# EAGLE board SparkFun_USDA_Watershed_Monitor (EAGLE 9.6.2)
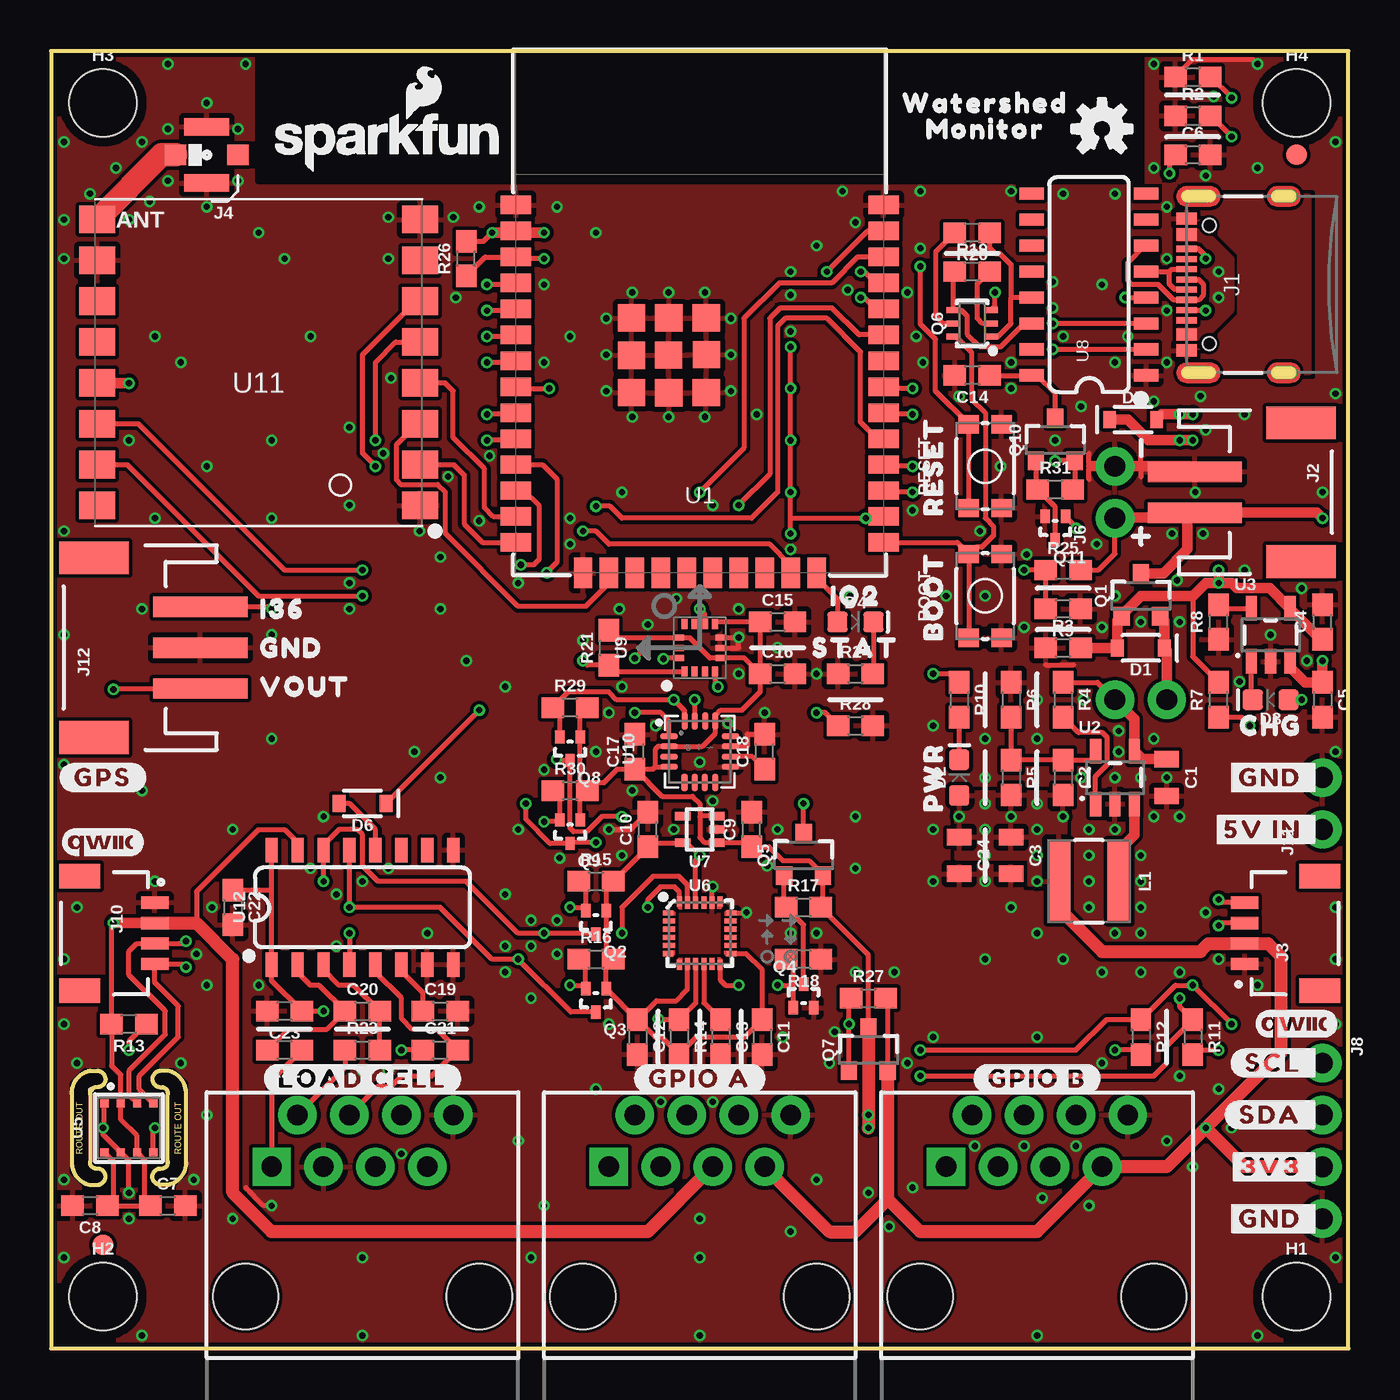
[diagram p1: board, top side]
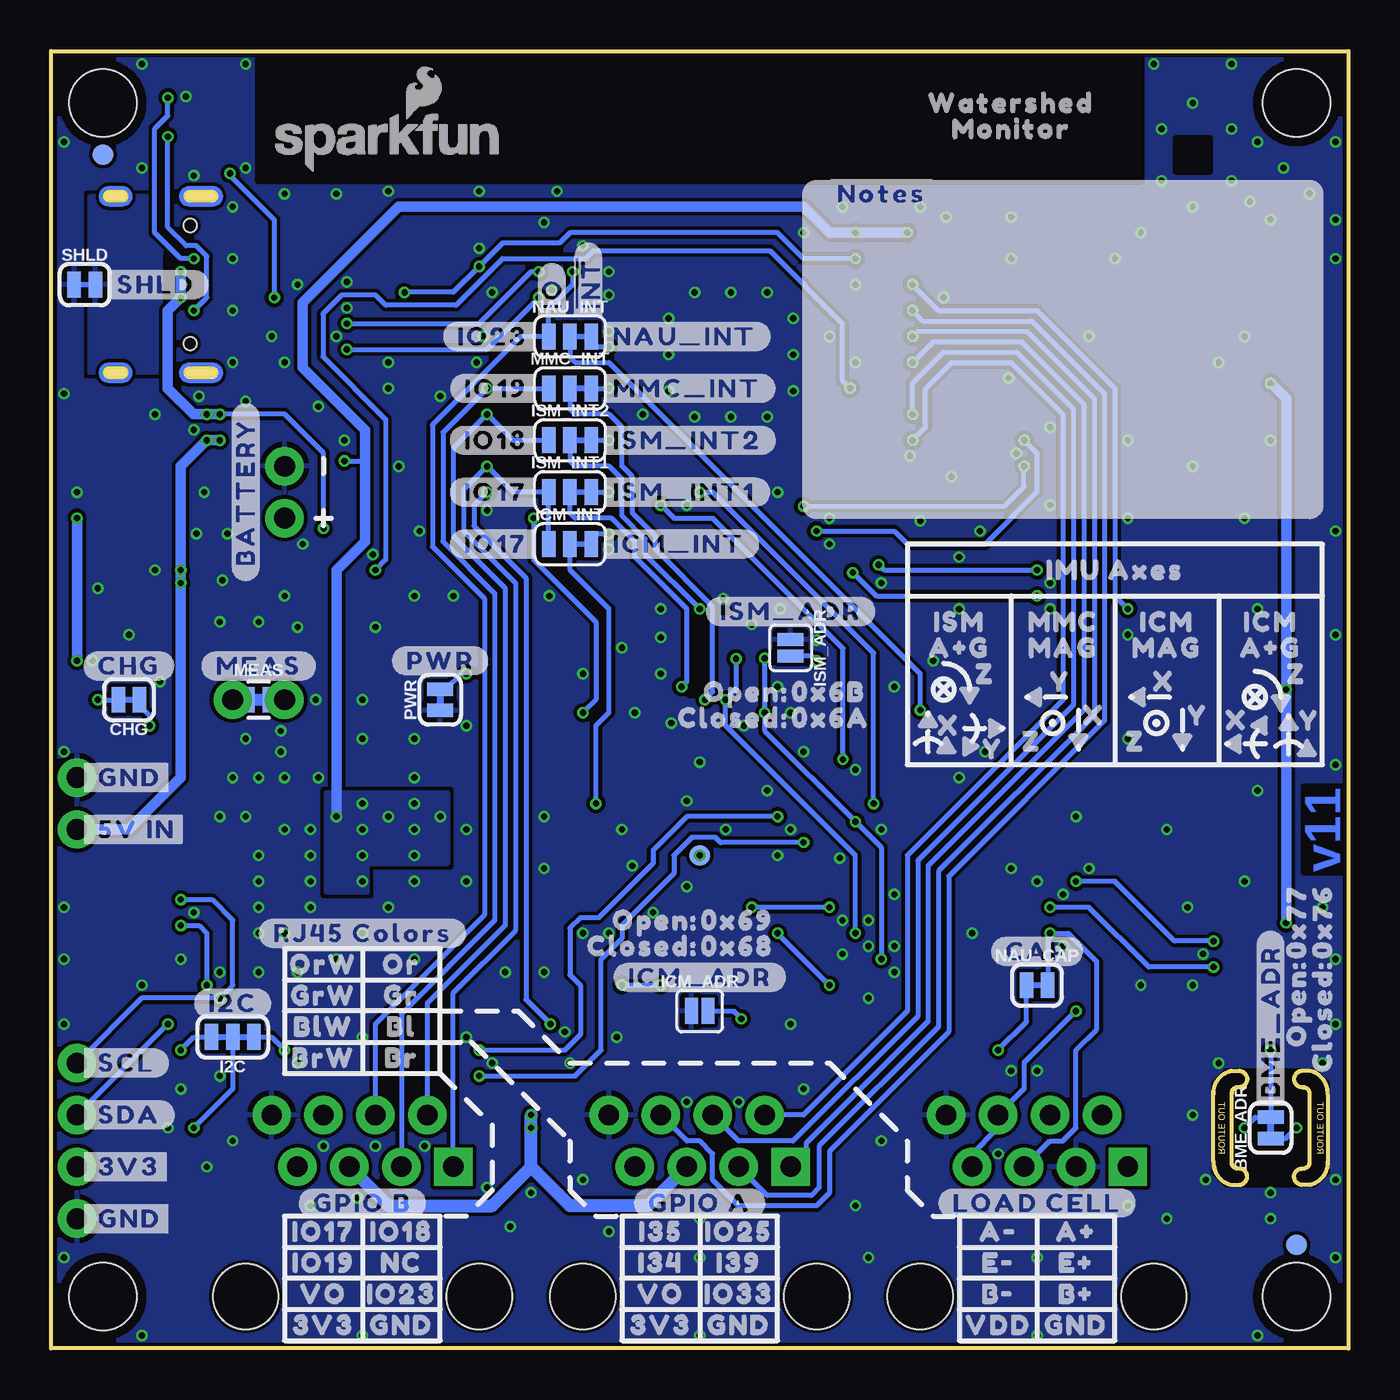
[diagram p2: board, bottom side, seen from below]

Size 63.5 x 63.5 mm. Coordinates in mm from the lower left corner, seen from the top.
Outline: 0,0 63.5,0 63.5,63.5 0,63.5 0,0
Copper layers (1*16): Top 0.035mm / dielectric 1.5mm / Bottom 0.035mm
Design rules "SparkFun-2-Layer-Minimum-JLCPCB": minimum track width 5mil, minimum drill 0.3mm, track to track 5mil, track to pad 5mil, pad to pad 5mil, via to via 5mil, smd to smd 5mil, copper to edge 7mil, drill to drill 7mil, minimum pad ring 5mil, minimum via ring 5mil, stop-mask expansion 2.5mil, vias tented up to drill 25mil, thermal gap 10mil
tRestrict: area 10.2,57.2 to 53.3,63.5; area 11.3,19.2 to 11.6,19.3; area 12.6,19.2 to 12.8,19.3; area 13.8,19.1 to 14.1,19.2; area 15.1,19.2 to 15.4,19.3; area 16.4,19.2 to 16.6,19.3; area 48,51.9 to 48.5,52.2; area 48,50.7 to 48.5,50.9; area 48,49.4 to 48.5,49.7; area 53.6,53.2 to 54.1,53.5
bRestrict: area 10.2,57.2 to 53.3,63.5; area 31.9,32 to 32.3,32.1; area 30.4,36.1 to 30.7,36.2
Milling: 44 lines

## Footprints (pad centres in the part's own frame; a part is rotated, then mirrored left to right if it is on the bottom)
SMT-JUMPER_2_NC_TRACE_SILK = smd 0.66 x 1.27: 1 -0.521,0; 2 0.521,0
TACTILE_SWITCH_SMD_4.6X2.8MM = smd 0.9 x 1: 1 -2.05,-0.8; 2 2.05,-0.8; 3 2.05,0.8; 4 -2.05,0.8
0805 = smd 0.8 x 1.2: 1 -0.9,0; 2 0.9,0
0603 = smd 1.1 x 1: 1 -0.85,0; 2 0.85,0
SOD-323 = smd 0.63 x 0.83: A 1.15,0; C -1.15,0
LED-0603 = smd 1 x 1: A -0.877,0; C 0.877,0
FIDUCIAL-1X2 = smd 1 x 1: 1 0,0
STAND-OFF = hole 3.302: 0,0
SMT-JUMPER_3_2-NC_TRACE_SILK = smd 0.66 x 1.27: 1 -1.041,0; 2 0,0; 3 1.041,0
SMT-JUMPER_2_NO_SILK = smd 0.635 x 1.27: 1 -0.406,0; 2 0.406,0
SMT-JUMPER_3_1-NC_TRACE_SILK = smd 0.66 x 1.27: 1 -1.041,0; 2 0,0; 3 1.041,0
USB-C-16P-2LAYER-PADS = smd 0.3 x 1: A5 -1.25,-0.34; A6 -0.25,-0.34; A7 0.25,-0.34; A8 1.25,-0.34; B5 1.75,-0.34; B6 0.75,-0.34; B7 -0.75,-0.34; B8 -1.75,-0.34 | smd 0.6 x 1: GND -3.225,-0.34; GND2 3.225,-0.34; VBUS1 -2.45,-0.34; VBUS2 2.45,-0.34 | drill 0.4 pad 0.6 long: SHLD1 -4.318,-0.915; SHLD2 4.318,-0.915; SHLD3 -4.318,-5.095; SHLD4 4.318,-5.095 | hole 0.65: -2.89,-1.445; 2.89,-1.445
JST-2-SMD = smd 1 x 4.6: 1 -1,-3.7; 2 1,-3.7 | smd 1.6 x 3.4: NC1 -3.4,1.5; NC2 3.4,1.5
JST04_1MM_RA = smd 0.6 x 1.35: 1 -1.5,0; 2 -0.5,0; 3 0.5,0; 4 1.5,0 | smd 1.2 x 2: NC1 2.8,-3.675; NC2 -2.8,-3.675
U.FL = smd 2.2 x 0.85: 1 0,1.375; 2 0,-1.375 | smd 1.05 x 1: FEED 1.525,0; NC -1.525,0
RJ45-8 = drill 1 pad 1.88 square: 1 -4.445,6.35 | drill 1 pad 1.88: 2 -3.175,8.89; 3 -1.905,6.35; 4 -0.635,8.89; 5 0.635,6.35; 6 1.905,8.89; 7 3.175,6.35; 8 4.445,8.89 | hole 3.2: -5.715,0; 5.715,0
1X02_NO_SILK = drill 1.016 pad 1.88: 1 0,0; 2 2.54,0
1X04_NO_SILK = drill 1.016 pad 1.88: 1 0,0; 2 2.54,0; 3 5.08,0; 4 7.62,0
JST-3-SMD = smd 1 x 4.6: 1 2.01,-4.77; 2 0.01,-4.77; 3 -1.99,-4.77 | smd 1.6 x 3.4: NC1 -4.39,0.43; NC2 4.41,0.43
INDUCTOR_4X4MM = smd 4.089 x 1.143: P$1 0,1.473; P$2 0,-1.473
COMBO-JUMPER_2_NC_TRACE = smd 0.635 x 1.27: 1 -0.508,0; 2 0.508,0 | drill 1.016 pad 1.88: 3 -1.27,0; 4 1.27,0
SOT23-3 = smd 0.8 x 0.9: 1 -0.95,-1; 2 0.95,-1; 3 0,1.1
SOT-416FL = smd 0.46 x 0.65: 1 -0.5,-1.1; 2 0.5,-1.1; 3 0,0.05
SC70-6 = smd 0.3 x 0.66: 1 -0.65,-0.92; 2 0,-0.92; 3 0.65,-0.92; 4 0.65,0.92; 5 0,0.92; 6 -0.65,0.92
PAD.03X.04 = smd 1.016 x 1.016: 1 0,0
ESP-WROOM-32D = smd 0.9 x 1.5: 1 6.43,9; 2 5.16,9; 3 3.89,9; 4 2.62,9; 5 1.35,9; 6 0.08,9; 7 -1.19,9; 8 -2.46,9; 9 -3.73,9; 10 -5,9; 11 -6.27,9; 12 -7.54,9; 13 -8.81,9; 14 -10.08,9; 25 -10.08,-9; 26 -8.81,-9; 27 -7.54,-9; 28 -6.27,-9; 29 -5,-9; 30 -3.73,-9; 31 -2.46,-9; 32 -1.19,-9; 33 0.08,-9; 34 1.35,-9; 35 2.62,-9; 36 3.89,-9; 37 5.16,-9; 38 6.43,-9 | smd 1.5 x 0.9: 15 -11.57,5.715; 16 -11.57,4.445; 17 -11.57,3.175; 18 -11.57,1.905; 19 -11.57,0.635; 20 -11.57,-0.635; 21 -11.57,-1.905; 22 -11.57,-3.175; 23 -11.57,-4.445; 24 -11.57,-5.715 | smd 1.33 x 1.33: GND -0.912,1.531; GNDT1 -2.751,3.346; GNDT2 -2.761,1.516; GNDT3 -2.751,-0.314; GNDT4 -0.891,-0.324; GNDT5 0.909,-0.314; GNDT6 0.909,1.516; GNDT7 0.909,3.346; GNDT8 -0.921,3.346
SOT23-5 = smd 0.55 x 1.2: 1 -0.95,-1.3; 2 0,-1.3; 3 0.95,-1.3; 4 0.95,1.3; 5 -0.95,1.3
LGA3.0X3.0 = smd 0.4 x 0.4: 1 1.2,1.2; 2 1.2,0.4; 3 1.2,-0.4; 4 1.2,-1.2; 5 -1.2,-1.2; 6 -1.2,-0.4; 7 -1.2,0.4; 8 -1.2,1.2
QFN24-3X3-ICM-20948 = smd 0.495 x 0.25: 1 -1.552,1; 6 -1.552,-1; 13 1.552,-1; 18 1.552,1 | smd 0.6 x 0.25: 2 -1.5,0.6; 3 -1.5,0.2; 4 -1.5,-0.2; 5 -1.5,-0.6; 14 1.5,-0.6; 15 1.5,-0.2; 16 1.5,0.2; 17 1.5,0.6 | smd 0.25 x 0.495: 7 -1,-1.552; 12 1,-1.552; 19 1,1.552; 24 -1,1.552 | smd 0.25 x 0.6: 8 -0.6,-1.5; 9 -0.2,-1.5; 10 0.2,-1.5; 11 0.6,-1.5; 20 0.6,1.5; 21 0.2,1.5; 22 -0.2,1.5; 23 -0.6,1.5
SC70 = smd 0.4 x 0.75: 1 -0.65,-0.825; 2 0,-0.825; 3 0.65,-0.825; 4 0.65,0.825; 5 -0.65,0.825
SO016 = smd 0.6 x 1.2: 1 -4.445,-2.8; 2 -3.175,-2.8; 3 -1.905,-2.8; 4 -0.635,-2.8; 5 0.635,-2.8; 6 1.905,-2.8; 7 3.175,-2.8; 8 4.445,-2.8; 9 4.445,2.8; 10 3.175,2.8; 11 1.905,2.8; 12 0.635,2.8; 13 -0.635,2.8; 14 -1.905,2.8; 15 -3.175,2.8; 16 -4.445,2.8
LGA-14L = smd 0.48 x 0.3: P1 -1.163,0.75; P2 -1.163,0.25; P3 -1.163,-0.25; P4 -1.163,-0.75; P8 1.163,-0.75; P9 1.163,-0.25; P10 1.163,0.25; P11 1.163,0.75 | smd 0.3 x 0.48: P5 -0.5,-1; P6 0,-1; P7 0.5,-1; P12 0.5,1; P13 0,1; P14 -0.5,1
LGA-16-3X3MM-4X4PINS = smd 0.3 x 0.85: 1 0.754,1.498; 2 0.254,1.498; 3 -0.246,1.498; 4 -0.746,1.498; 9 -0.746,-1.506; 10 -0.246,-1.506; 11 0.254,-1.506; 12 0.754,-1.506 | smd 0.85 x 0.3: 5 -1.508,0.746; 6 -1.508,0.246; 7 -1.508,-0.254; 8 -1.508,-0.754; 13 1.496,-0.764; 14 1.496,-0.264; 15 1.496,0.236; 16 1.496,0.736
RFM95 = smd 1.75 x 1.35: 3.3V 7.9,1; !RESET -7.9,-3; ANT 7.9,-7; DIO0 7.9,3; DIO1 7.9,5; DIO2 7.9,7; DIO3 7.9,-3; DIO4 7.9,-1; DIO5 -7.9,-5; GND@1 -7.9,7; GND@2 -7.9,-7; GND@3 7.9,-5; NSS -7.9,-1; SCK -7.9,1; SDI -7.9,3; SDO -7.9,5
SO16 = smd 0.6 x 1.2: 1 -4.445,-2.8; 2 -3.175,-2.8; 3 -1.905,-2.8; 4 -0.635,-2.8; 5 0.635,-2.8; 6 1.905,-2.8; 7 3.175,-2.8; 8 4.445,-2.8; 9 4.445,2.8; 10 3.175,2.8; 11 1.905,2.8; 12 0.635,2.8; 13 -0.635,2.8; 14 -1.905,2.8; 15 -3.175,2.8; 16 -4.445,2.8

## Placement (x,y rotation side)
BME_ADR  JUMPER-SMT_2_NC_TRACE_SILK  [SMT-JUMPER_2_NC_TRACE_SILK]  3.81,10.79 90 bottom
BOOT  MOMENTARY-SWITCH-SPST-SMD-4.6X2.8MM  [TACTILE_SWITCH_SMD_4.6X2.8MM]  45.72,36.83 90 top
C1  22uF  [0805]  54.61,27.94 270 top
C2  22pF  [0603]  49.53,27.94 270 top
C3  22uF  [0805]  46.99,24.13 270 top
C4  4.7uF  [0603]  62.23,35.56 90 top
C5  4.7uF  [0603]  62.23,31.75 270 top
C6  10nF  [0603]  55.88,58.42 0 top
C7  0.1uF  [0603]  5.71,6.99 0 top
C8  0.1uF  [0603]  1.91,6.99 180 top
C9  1.0uF  [0603]  34.29,25.4 90 top
C10  1.0uF  [0603]  29.21,25.4 90 top
C11  0.1uF  [0603]  34.8,15.24 270 top
C12  0.1uF  [0603]  28.7,15.24 270 top
C13  0.1uF  [0603]  32.77,15.24 270 top
C14  0.1uF  [0603]  45.09,47.62 180 top
C15  DNP  [0603]  35.56,35.56 0 top
C16  DNP  [0603]  35.56,33.02 0 top
C17  DNP  [0603]  28.57,29.21 90 top
C18  DNP  [0603]  34.92,29.21 90 top
C19  0.1uF  [0603]  19.05,16.51 0 top
C20  0.1uF  [0603]  15.24,16.51 0 top
C21  330pF  [0603]  19.05,14.61 0 top
C22  0.1uF  [0603]  8.89,21.59 270 top
C23  10uF  [0603]  11.43,16.51 180 top
C24  22uF  [0805]  44.45,24.13 270 top
CHG  JUMPER-SMT_2_NC_TRACE_SILK  [SMT-JUMPER_2_NC_TRACE_SILK]  59.69,31.75 180 bottom
D1  1A/23V/620mV  [SOD-323]  53.34,34.29 180 top
D2  DNP  [LED-0603]  44.45,27.94 90 top
D3  Yellow  [LED-0603]  59.69,31.75 180 top
D4  BLUE  [LED-0603]  39.37,35.56 0 top
D5  1A/23V/620mV  [SOD-323]  52.96,45.47 0 top
D6  1A/23V/620mV  [SOD-323]  15.24,26.67 180 top
FD1  FIDUCIAL1X2  [FIDUCIAL-1X2]  2.54,5.08 0 bottom
FD2  FIDUCIAL1X2  [FIDUCIAL-1X2]  2.54,5.08 0 top
FD3  FIDUCIAL1X2  [FIDUCIAL-1X2]  60.96,58.42 0 top
FD4  FIDUCIAL1X2  [FIDUCIAL-1X2]  60.96,58.42 0 bottom
FRAME1  FRAME-LEDGER  [CREATIVE_COMMONS]  8.89,-44.45 0 top  (outside the outline)
H1  STAND-OFF  [STAND-OFF]  60.96,2.54 0 top
H2  STAND-OFF  [STAND-OFF]  2.54,2.54 0 top
H3  STAND-OFF  [STAND-OFF]  2.54,60.96 0 top
H4  STAND-OFF  [STAND-OFF]  60.96,60.96 0 top
I2C  JUMPER-SMT_3_2-NC_TRACE_SILK  [SMT-JUMPER_3_2-NC_TRACE_SILK]  54.61,15.24 180 bottom
ICM_ADR  JUMPER-SMT_2_NO_SILK  [SMT-JUMPER_2_NO_SILK]  31.75,16.51 0 bottom
ICM_INT  JUMPER-SMT_3_1-NC_TRACE_SILK  [SMT-JUMPER_3_1-NC_TRACE_SILK]  38.1,39.37 0 bottom
ISM_ADR  JUMPER-SMT_2_NO_SILK  [SMT-JUMPER_2_NO_SILK]  27.3,34.29 270 bottom
ISM_INT1  JUMPER-SMT_3_1-NC_TRACE_SILK  [SMT-JUMPER_3_1-NC_TRACE_SILK]  38.1,41.91 0 bottom
ISM_INT2  JUMPER-SMT_3_1-NC_TRACE_SILK  [SMT-JUMPER_3_1-NC_TRACE_SILK]  38.1,44.45 0 bottom
J1  [USB-C-16P-2LAYER-PADS]  55.24,52.07 90 top
J2  [JST-2-SMD]  59.69,41.91 270 top
J3  QWIIC_RIGHT_ANGLE  [JST04_1MM_RA]  58.42,20.32 90 top
J4  U.FL  [U.FL]  7.62,58.42 180 top
J5  RJ45  [RJ45-8]  15.24,2.54 0 top
J6  [1X02_NO_SILK]  52.07,40.64 90 top
J7  RJ45  [RJ45-8]  31.75,2.54 0 top
J8  [1X04_NO_SILK]  62.23,13.97 270 top
J9  RJ45  [RJ45-8]  48.26,2.54 0 top
J10  QWIIC_RIGHT_ANGLE  [JST04_1MM_RA]  5.08,20.32 270 top
J11  [1X02_NO_SILK]  62.23,25.4 90 top
J12  3-PIN SMD  [JST-3-SMD]  2.54,34.29 90 top
L1  2.2μH  [INDUCTOR_4X4MM]  50.8,22.86 270 top
LOGO1  SFE_LOGO_NAME_FLAME.1_INCH  [SFE_LOGO_NAME_FLAME_.1]  16.51,59.05 0 top
LOGO2  OSHW-LOGOS  [OSHW-LOGO-S]  51.44,59.69 0 top
LOGO3  QWIIC_LOGO_4MM  [QWIIC_4MM]  60.96,15.88 0 top
LOGO4  QWIIC_LOGO_4MM  [QWIIC_4MM]  2.54,24.77 0 top
LOGO5  SFE_LOGO_NAME_FLAME.1_INCH  [SFE_LOGO_NAME_FLAME_.1]  46.99,59.05 0 bottom
MEAS  JUMPER-COMBO_2_NC_TRACE  [COMBO-JUMPER_2_NC_TRACE]  53.34,31.75 0 bottom
MMC_INT  JUMPER-SMT_3_1-NC_TRACE_SILK  [SMT-JUMPER_3_1-NC_TRACE_SILK]  38.1,46.99 0 bottom
NAU_CAP  JUMPER-SMT_2_NC_TRACE_SILK  [SMT-JUMPER_2_NC_TRACE_SILK]  15.24,17.78 0 bottom
NAU_INT  JUMPER-SMT_3_1-NC_TRACE_SILK  [SMT-JUMPER_3_1-NC_TRACE_SILK]  38.1,49.53 0 bottom
PWR  JUMPER-SMT_2_NC_TRACE_SILK  [SMT-JUMPER_2_NC_TRACE_SILK]  44.45,31.75 90 bottom
Q1  20V/4.2A/52mΩ/1.4W  [SOT23-3]  53.34,36.83 0 top
Q2  20V/0.2A/8MHz/1.2Ω/1Vth  [SOT-416FL]  26.67,20.32 180 top
Q3  20V/0.2A/8MHz/1.2Ω/1Vth  [SOT-416FL]  26.67,16.51 180 top
Q4  20V/0.2A/8MHz/1.2Ω/1Vth  [SOT-416FL]  36.83,17.78 0 top
Q5  20V/4.2A/52mΩ/1.4W  [SOT23-3]  36.83,24.13 0 top
Q6  [SC70-6]  45.09,50.16 90 top
Q7  20V/4.2A/52mΩ/1.4W  [SOT23-3]  40.01,14.61 0 top
Q8  20V/0.2A/8MHz/1.2Ω/1Vth  [SOT-416FL]  25.4,28.83 180 top
Q9  20V/0.2A/8MHz/1.2Ω/1Vth  [SOT-416FL]  25.4,24.77 180 top
Q10  20V/4.2A/52mΩ/1.4W  [SOT23-3]  49.15,44.45 0 top
Q11  20V/0.2A/8MHz/1.2Ω/1Vth  [SOT-416FL]  49.15,39.62 180 top
R1  5.1k  [0603]  55.88,62.23 0 top
R2  5.1k  [0603]  55.88,60.33 0 top
R3  100k  [0603]  49.53,34.29 0 top
R4  100k  [0603]  49.53,31.75 270 top
R5  453k  [0603]  46.99,27.94 270 top
R6  100k  [0603]  46.99,31.75 270 top
R7  4.7k  [0603]  57.15,31.75 90 top
R8  2.2k  [0603]  57.15,35.56 90 top
R9  100k  [0603]  49.53,36.2 180 top
R10  DNP  [0603]  44.45,31.75 270 top
R11  2.2k  [0603]  55.88,15.24 270 top
R12  2.2k  [0603]  53.34,15.24 270 top
R13  100k  [0603]  3.81,15.88 180 top
R14  100k  [0603]  30.73,15.24 270 top
R15  2.2k  [0603]  26.67,22.86 0 top
R16  2.2k  [0603]  26.67,19.05 0 top
R17  100k  [0603]  36.83,21.59 0 top
R18  100k  [0603]  36.83,19.05 180 top
R19  10k  [0603]  45.09,52.7 0 top
R20  10k  [0603]  45.09,54.61 180 top
R21  DNP  [0603]  27.3,34.29 90 top
R22  47  [0603]  11.43,14.61 180 top
R23  47  [0603]  15.24,14.61 0 top
R24  2.2k  [0603]  39.37,33.02 0 top
R25  100k  [0603]  49.53,38.1 0 top
R26  100k  [0603]  20.32,53.34 90 top
R27  100k  [0603]  40.01,17.14 0 top
R28  100k  [0603]  39.37,30.48 0 top
R29  2.2k  [0603]  25.4,31.37 0 top
R30  2.2k  [0603]  25.4,27.3 0 top
R31  100k  [0603]  49.15,42.04 0 top
RESET  MOMENTARY-SWITCH-SPST-SMD-4.6X2.8MM  [TACTILE_SWITCH_SMD_4.6X2.8MM]  45.72,43.18 90 top
SHLD  JUMPER-SMT_2_NC_TRACE_SILK  [SMT-JUMPER_2_NC_TRACE_SILK]  61.85,52.07 0 bottom
TP1  TEST-POINT3X4  [PAD.03X.04]  31.75,24.13 0 bottom
U1  ESP-WROOM-3232D  [ESP-WROOM-32D]  31.75,49.53 90 top
U2  AP3429A  [SOT23-5]  52.07,27.94 0 top
U3  MCP73831  [SOT23-5]  59.69,34.92 0 top
U5  BME680  [LGA3.0X3.0]  3.81,10.79 90 top
U6  9DoF IMU  [QFN24-3X3-ICM-20948]  31.75,20.32 0 top
U7  1.8V/100mA  [SC70]  31.75,25.4 90 top
U8  CH340C  [SO016]  50.8,52.07 90 top
U9  DNP  [LGA-14L]  31.75,34.29 90 top
U10  DNP  [LGA-16-3X3MM-4X4PINS]  31.75,29.21 90 top
U11  RFM9XRFM95  [RFM95]  10.16,48.26 180 top
U12  NAU7802SOIC  [SO16]  15.24,21.59 0 top
U$2  [WATERSHED0]  45.72,60.96 0 top
U$3  [MONITOR0]  45.72,59.69 0 top
U$4  [GND0]  29.84,1.14 0 bottom
U$5  [#IO17#0]  39.5,39.37 0 bottom
U$6  [#GND_#0]  62.23,6.35 0 top
U$7  [#_GND#0]  62.23,6.35 0 bottom
U$8  [GND0]  46.35,1.14 0 bottom
U$9  [#MEAS#0]  53.34,33.4 0 bottom
U$10  [3V30]  50.16,1.14 0 bottom
U$11  [GND0]  13.34,1.14 0 bottom
U$12  [A#0]  17.14,5.71 0 bottom
U$13  [VDD0]  17.14,1.14 0 bottom
U$14  [#CHG#0]  59.69,33.4 0 bottom
U$15  [#I2C#0]  54.61,16.89 0 bottom
U$16  [CHG0]  59.69,30.48 0 top
U$17  [#CAP#0]  15.24,19.43 0 bottom
U$18  [#BME_ADR#0]  3.81,11.56 90 bottom
U$19  [#ICM_ADR#0]  31.75,18.16 0 bottom
U$20  [#ISM_ADR#0]  27.3,36.07 0 bottom
U$21  [#BATTERY#0]  53.98,41.91 90 bottom
U$22  [#SHLD#0]  60.96,52.07 0 bottom
U$23  [I360]  9.53,36.2 0 top
U$24  [3V30]  33.66,1.14 0 bottom
U$25  [VO0]  33.66,2.67 0 bottom
U$26  [VOUT0]  9.53,32.38 0 top
U$27  [RESET0]  43.18,43.18 90 top
U$28  [BOOT0]  43.18,36.83 90 top
U$29  [PWR0]  43.18,27.94 90 top
U$30  [STAT0]  39.37,34.29 0 top
U$31  [IO20]  39.37,36.83 0 top
U$32  [ORW0]  50.16,18.8 0 bottom
U$33  [OR0]  46.35,18.8 0 bottom
U$34  [GRW0]  50.16,17.27 0 bottom
U$35  [GR0]  46.35,17.27 0 bottom
U$36  [BLW0]  50.16,15.75 0 bottom
U$37  [BL0]  46.35,15.75 0 bottom
U$38  [BRW0]  50.16,14.22 0 bottom
U$39  [BR0]  46.35,14.22 0 bottom
U$40  [A#1]  13.34,5.71 0 bottom
U$41  [B#0]  17.14,2.67 0 bottom
U$42  [B#1]  13.34,2.67 0 bottom
U$43  [E#0]  17.14,4.19 0 bottom
U$44  [E#1]  13.34,4.19 0 bottom
U$45  [#RJ45_COLORS#0]  48.26,20.32 0 bottom
U$46  [#PWR#0]  44.45,33.66 0 bottom
U$47  [#3V3_#0]  62.23,8.89 0 top
U$48  [#SDA_#0]  62.23,11.43 0 top
U$49  [ORDERING_INSTRUCTIONS]  101.6,50.8 0 top  (outside the outline)
U$50  [#LOAD_CELL#0]  15.24,13.21 0 top
U$51  [#GPIO_A#0]  31.75,13.21 0 top
U$52  [IO250]  29.84,5.71 0 bottom
U$53  [#GPIO_B#0]  48.26,13.21 0 top
U$54  [IO330]  29.84,2.67 0 bottom
U$55  [#LOAD_CELL#0]  15.24,7.11 0 bottom
U$56  [#SCL_#0]  62.23,13.97 0 top
U$57  [NC0]  46.35,4.19 0 bottom
U$58  [IO170]  50.16,5.71 0 bottom
U$59  [IO180]  46.35,5.71 0 bottom
U$60  [IO190]  50.16,4.19 0 bottom
U$61  [I340]  33.66,4.19 0 bottom
U$62  [I350]  33.66,5.71 0 bottom
U$64  [I390]  29.84,4.19 0 bottom
U$65  [#IO19#0]  39.5,46.99 0 bottom
U$66  [#IO18#0]  39.5,44.45 0 bottom
U$67  [#IO17#0]  39.5,41.91 0 bottom
U$68  [#IO23#0]  39.5,49.53 0 bottom
U$69  [VO0]  50.16,2.67 0 bottom
U$70  [#NAU_INT#0]  36.7,49.53 0 bottom
U$71  [#MMC_INT#0]  36.7,46.99 0 bottom
U$72  [#ISM_INT2#0]  36.7,44.45 0 bottom
U$73  [#ISM_INT1#0]  36.7,41.91 0 bottom
U$74  [#ICM_INT#0]  36.7,39.37 0 bottom
U$75  [#IO#0]  38.99,50.16 90 bottom
U$76  [##INT##0]  37.21,50.16 90 bottom
U$77  [#NOTES#0]  22.86,56.52 0 bottom
U$78  [IO230]  46.35,2.67 0 bottom
U$79  [#GND_#0]  62.23,27.94 0 top
U$80  [#_GND#0]  62.23,27.94 0 bottom
U$81  [#_SCL#1]  62.23,13.97 0 bottom
U$82  [OPEN#0]  2.54,19.68 90 bottom
U$83  [CLOSED#0]  1.27,19.68 90 bottom
U$84  [#_SDA#2]  62.23,11.43 0 bottom
U$85  [#_3V3#0]  62.23,8.89 0 bottom
U$86  [#GPIO_A#0]  31.75,7.11 0 bottom
U$87  [#GPIO_B#0]  48.26,7.11 0 bottom
U$88  [#GPS#0]  2.54,27.94 0 top
U$89  [GND3]  9.53,34.29 0 top
U$94  [X0]  5.46,30.73 0 bottom
U$95  [Y0]  1.91,30.73 0 bottom
U$96  [Z0]  2.54,33.02 0 bottom
U$100  [X0]  19.56,30.48 0 bottom
U$102  [Y0]  17.4,29.34 0 bottom
U$103  [Z0]  17.78,33.02 0 bottom
U$104  [X0]  12.45,30.99 0 bottom
U$105  [Y0]  14.1,32.64 0 bottom
U$106  [Z0]  15.49,29.72 0 bottom
U$110  [ICM0]  3.81,35.56 0 bottom
U$111  [ISM0]  19.05,35.56 0 bottom
U$112  [MMC0]  13.97,35.56 0 bottom
U$113  [IMU_AXES0]  11.43,38.1 0 bottom
U$115  [WATERSHED0]  16.51,60.96 0 bottom
U$116  [MONITOR0]  16.51,59.69 0 bottom
U$117  [#5V_IN_#0]  62.23,25.4 0 top
U$118  [#_5V_IN#0]  62.23,25.4 0 bottom
U$119  [0X770]  2.54,18.41 90 bottom
U$120  [0X760]  1.27,18.41 90 bottom
U$121  [OPEN#0]  26.67,32.13 0 bottom
U$122  [CLOSED#0]  26.67,30.86 0 bottom
U$123  [0X6A0]  27.94,30.86 0 bottom
U$124  [0X6B0]  27.94,32.13 0 bottom
U$125  [OPEN#0]  31.11,20.95 0 bottom
U$126  [CLOSED#0]  31.11,19.68 0 bottom
U$127  [0X690]  32.38,20.95 0 bottom
U$128  [0X680]  32.38,19.68 0 bottom
U$137  [ICM0]  8.89,35.56 0 bottom
U$138  [X0]  9.02,32.64 0 bottom
U$139  [Y0]  7.37,30.99 0 bottom
U$140  [Z0]  10.41,29.72 0 bottom
U$141  [MAG0]  8.89,34.29 0 bottom
U$142  [MAG0]  13.97,34.29 0 bottom
U$143  [A#G0]  19.05,34.29 0 bottom
U$144  [A#G0]  3.81,34.29 0 bottom

## Tracks (layer width: path | path; a pad name or v marks a point on that pad's centre or on a via)
1.8V  (via drill 0.3)
  Top 0.254: U6.13 34.02,19.32 34.8,18.54 C11.1 33.95,15.24 31.58,15.24 R14.2 29.88,15.24 29.55,15.24 C12.1 | C12.1 29.63,17.02 30.61,17.02 31.15,17.56 U6.8 | C12.1 Q3.1 27.17,18.7 R16.2 27.17,19.4 Q2.1 27.17,22.51 R15.2 C10.1 29.41,24.75 U7.5 31.13,24.75 TP1.1 31.55,23.93 U6.22
  other vias: 31.75,24.13
3.3V  (via drill 0.3)
  Top 0.254: 46.96,27.06 R5.2 | R26.2 21.17,54.19 v21.59,54.61 | Q7.2 40.95,17.05 R27.2 | R31.2 50.1,42.14 Q10.2 49.16,43.45 v49.15,43.43
  Top 0.508: v21.59,54.61 22.67,54.61 U1.2 22.83,54.61 v24.13,54.61 | L1.P$2 49.33,21.54
  Top 0.635: 49.33,21.54 51.44,19.43 56.26,19.43 56.65,19.82 J3.2 59.55,19.82 60.2,19.18 60.2,14.48 v56.52,10.79 | v56.52,10.79 54.61,8.89 J9.7 48.26,5.71 42.55,5.71 40.95,7.3 | J8.3 58.42,8.89 v56.52,10.79 | 40.95,7.3 Q7.2 | J7.7 38.1,5.71 39.37,5.71 40.95,7.3
  Bottom 0.254: I2C.2 54.61,12.7 v56.52,10.79 | v49.15,43.43 48.13,43.43
  Bottom 0.508: v21.59,54.61 v24.13,54.61 25.4,54.61 26.67,55.88 46.48,55.88 51.18,51.18 51.18,48.01 48.13,44.96 48.13,43.43 48.13,39.5 49.53,38.1 v49.53,26.04
  other vias: 48.26,25.4 48.26,26.67 48.26,24.13 45.72,24.13 46.99,26.04 45.72,25.4 45.72,26.67 44.45,26.04 48.26,22.86
  pour Top (isolate 0.178): 44.32,27.18 44.32,24 47.88,24 47.88,22.73 49.66,22.73 49.66,27.18
  pour Bottom (isolate 0.178): 44.07,27.18 50.04,27.18 50.04,22.35 48.01,22.35 48.01,23.75 44.07,23.75
3V3_EN
  Top 0.254: U2.1 51.12,28.01 51.69,28.57 51.69,29.91 51.46,30.14 50.29,30.14 R4.2
5V  (via drill 0.3)
  Top 0.254: R7.2 55.88,33.87 55.88,36.83
  Top 0.508: R3.2 D1.A 52.19,35.63 Q1.1 52.39,35.88 53.34,36.83 55.88,36.83 56.52,37.47 v57.15,37.47 | C4.1 62.16,34.71 U3.4 59.65,37.21 58.04,37.21 57.78,37.47 v57.15,37.47 | v55.88,44.45 v55.24,44.45 53.71,44.45 52.7,45.47 D5.C | v57.15,37.47 v57.15,38.1
  Bottom 0.508: J11.1 59.69,25.4 57.15,27.94 v57.15,37.47 v57.15,38.1 57.15,43.18 v55.88,44.45 v55.24,44.45
DTR
  Top 0.254: Q6.1 46.34,49.52 46.99,50.16 46.99,51.44 | 46.99,51.44 46.99,53.05 46.44,53.59 46.23,53.59 45.94,53.89 R20.1 | U8.13 46.99,51.44
ESP_EN  (via drill 0.3)
  Top 0.254: Q6.3 46.2,51.01 v46.2,51.69 | RESET.4 RESET.3 43.3,46.85 43.3,49.39 42.55,50.15 v42.55,52.96 | v24.13,53.34 22.83,53.34 U1.3 21.25,53.42 R26.1
  Bottom 0.254: v46.2,51.69 43.81,51.69 v42.55,52.96 41.4,54.1 38.61,54.1 38.1,54.61 27.94,54.61 26.67,53.34 v24.13,53.34
ESP_I34  (via drill 0.3)
  Top 0.254: U1.6 22.67,49.53 v21.34,49.53
  Bottom 0.254: v21.34,49.53 21.08,49.78 15.75,49.78 12.45,46.48 12.45,30.99 20.07,23.37 20.07,15.75 25.91,9.91 25.91,7.87 26.29,7.49 28.45,7.49 J7.3
ESP_I35  (via drill 0.3)
  Top 0.254: U1.7 22.67,48.26 v21.34,48.26
  Bottom 0.254: v21.34,48.26 20.32,49.28 16,49.28 12.95,46.23 12.95,31.24 20.57,23.62 20.57,16 26.54,10.03 26.54,9.65 J7.1
ESP_I36/GPS_TX  (via drill 0.3)
  Top 0.254: U1.4 22.67,52.07 v21.34,52.07 | v10.79,36.2 10.69,36.3 J12.1
  Bottom 0.254: v21.34,52.07 20.07,50.8 15.24,50.8 11.43,46.99 11.43,36.83 v10.79,36.2
ESP_I39  (via drill 0.3)
  Top 0.254: U1.5 22.67,50.8 v21.34,50.8
  Bottom 0.254: v21.34,50.8 20.83,50.29 15.49,50.29 11.94,46.74 11.94,30.73 19.56,23.11 19.56,15.49 25.4,9.65 25.4,7.62 26.04,6.99 29.84,6.99 31.11,8.26 31.11,9.53 31.75,10.16 32.38,10.16 J7.6
ESP_IO0/BOOT
  Top 0.254: BOOT.3 BOOT.4 | Q6.6 44.29,49.52 45.05,48.75 45.05,46.47 45.72,45.8 45.72,40.63 46.13,40.23 46.13,39.78 45.56,39.22 45.26,39.22 BOOT.3 | U1.25 44.35,39.45 BOOT.3
ESP_IO1/ESP_TX  (via drill 0.3)
  Top 0.254: U8.3 v49.02,50.16 | U1.35 40.37,52.15 39.81,52.7 v39.62,52.7
  Bottom 0.254: v49.02,50.16 42.55,50.16 40.01,52.7 v39.62,52.7
ESP_IO2/STAT
  Top 0.254: U1.24 37.47,37.71 38.49,36.68 D4.A
ESP_IO3/ESP_RX  (via drill 0.3)
  Top 0.254: U8.2 v49.02,48.9 | U1.34 40.37,50.88 39.81,51.44 v39.62,51.44
  Bottom 0.254: v49.02,48.9 42.16,48.9 v39.62,51.44
ESP_IO4/INT_COM  (via drill 0.3)
  Top 0.254: v36.2,39.88 36.2,40.64 | 36.2,40.64 v36.2,41.91 v36.2,44.45 v36.2,46.99 v36.2,49.02 | R28.1 37.88,31.11 v37.47,31.11 | 36.2,40.64 v39.88,40.64 40.67,40.64 U1.26
  Bottom 0.254: MMC_INT.3 v36.2,46.99 | NAU_INT.3 37.06,49.28 36.8,49.02 v36.2,49.02 | ISM_INT2.3 v36.2,44.45 | ISM_INT1.3 v36.2,41.91 | ICM_INT.3 37.06,39.62 36.8,39.88 v36.2,39.88 | v39.88,40.64 39.88,38.61 36.83,35.56 36.83,31.75 v37.47,31.11
ESP_IO5/!RFM_RST!  (via drill 0.3)
  Top 0.254: U1.29 40.43,44.53 39.62,45.34 39.62,48.77 37.97,50.42 35.94,50.42 35.56,50.04 35.56,41.91 34.29,40.64 27.94,40.64 27.36,41.22 v26.67,41.22 | v15.88,43.18 15.24,43.81 15.24,48.64 17.86,51.26 U11.!RESET
  Bottom 0.254: v26.67,41.22 16.82,41.22 15.88,42.16 v15.88,43.18
ESP_IO12/POCI
  Top 0.254: U11.SDO 19.71,43.26 20.22,42.75 20.22,40.36 21.13,39.45 U1.14
ESP_IO13/PICO
  Top 0.254: U11.SDI 17.93,45.26 16.89,44.22 16.89,42.52 17.12,42.29 18.92,42.29 19.3,41.91 19.3,39.88 22.86,36.32 26.16,36.32 27.3,37.47 U1.16
ESP_IO14/SCK
  Top 0.254: U11.SCK 19.29,47.26 19.68,46.86 19.68,44.58 21.21,43.05 21.21,41.15 21.64,40.72 U1.13
ESP_IO15/!RFM_CS!  (via drill 0.3)
  Top 0.254: U1.23 36.2,38.35 35.18,39.37 27.3,39.37 26.67,40.01 v26.04,40.01 | v15.88,44.45 15.88,48.26 16.88,49.26 U11.NSS
  Bottom 0.254: v26.04,40.01 22.23,40.01 21.59,39.37 17.78,39.37 15.24,41.91 15.24,43.81 v15.88,44.45
ESP_IO16/!VOUT_EN!  (via drill 0.3)
  Top 0.254: v42.16,41.91 40.83,41.91 U1.27 | Q7.1 v39.05,15.88 39.05,17.05 R27.1
  Bottom 0.254: v42.16,41.91 42.8,41.27 42.8,40.26 40.26,37.72 40.26,17.08 v39.05,15.88
ESP_IO17  (via drill 0.3)
  Top 0.254: v42.16,43.18 40.83,43.18 U1.28
  Bottom 0.254: J9.1 43.81,17.4 40.77,20.45 40.77,37.47 43.31,40.01 43.31,42.04 v42.16,43.18 40.89,41.91 ISM_INT1.1 ICM_INT.1
ESP_IO18  (via drill 0.3)
  Top 0.254: v42.16,45.72 40.83,45.72 U1.30
  Bottom 0.254: ISM_INT2.1 40.89,44.45 v42.16,45.72 43.81,44.07 43.81,39.75 41.27,37.21 41.27,20.7 45.09,16.89 J9.2
ESP_IO19  (via drill 0.3)
  Top 0.254: v42.16,46.99 40.83,46.99 U1.31
  Bottom 0.254: J9.3 46.35,16.38 41.78,20.95 41.78,36.96 44.32,39.5 44.32,44.83 v42.16,46.99 41.91,46.99 41.43,46.99 MMC_INT.1
ESP_IO21/SDA  (via drill 0.3)
  Top 0.229: 26.23,25.3 25.57,25.3
  Top 0.254: J3.3 57.27,20.82 v57.15,20.7 | U1.33 39.54,49.61 38.23,50.93 35.69,50.93 35.18,50.42 35.18,42.8 v33.66,41.27 | v42.55,14.61 50.16,14.61 51.65,16.09 R12.1 55.03,17.78 v55.88,17.78 v57.78,15.88 | v24.74,28.83 24.79,28.78 Q8.3 25.4,25.47 25.57,25.3 | v27.94,26.04 26.97,26.04 26.23,25.3
  Bottom 0.254: v33.66,41.27 33.02,40.64 31.11,40.64 24.74,34.27 v24.74,28.83 | v57.15,20.7 56.26,20.7 55.88,20.32 v55.88,17.78 | v57.78,15.88 J8.2 | v27.94,26.04 32.38,26.04 34.04,24.38 34.04,23.75 36.7,21.08 37.59,21.08 38.1,20.57 38.1,18.29 37.59,17.78 37.59,15.37 38.35,14.61 v42.55,14.61
ESP_IO22/SCL  (via drill 0.3)
  Top 0.254: J3.4 57.3,21.82 v57.15,21.97 | U1.36 39.48,53.42 38.21,52.15 35.64,52.15 33.91,50.42 33.91,44.07 v31.75,41.91 | v42.55,13.34 53.98,13.34 54.61,13.97 54.61,14.82 R11.1 55.24,16.73 v55.24,17.14 | v26.67,24.77 25.45,24.77 Q9.3 24.43,24.71 23.24,25.91 v23.24,26.67
  Bottom 0.254: v57.15,21.97 55.63,21.97 54.61,20.95 54.61,17.78 v55.24,17.14 59.05,17.14 J8.1 | v31.75,41.91 31.11,41.91 23.24,34.04 v23.24,26.67 | v26.67,24.77 30.73,24.77 30.99,25.02 32.13,25.02 33.02,24.13 33.02,23.24 35.56,20.7 35.56,20.07 36.58,19.05 36.58,14.61 37.85,13.34 v42.55,13.34
ESP_IO23  (via drill 0.3)
  Top 0.254: U1.37 39.96,54.69 v37.97,52.7
  Bottom 0.254: v37.97,52.7 37.97,52.07 39.14,50.9 NAU_INT.1 40.51,49.53 44.83,45.21 44.83,39.24 42.29,36.7 42.29,21.21 47.62,15.88 J9.4
ESP_IO25  (via drill 0.3)
  Top 0.254: U1.10 22.67,44.45 v21.34,44.45
  Bottom 0.254: v21.34,44.45 20.7,45.09 20.7,46.99 19.43,48.26 16.51,48.26 13.97,45.72 13.97,31.75 21.59,24.13 21.59,16.51 26.67,11.43 J7.2
ESP_IO26/RFM_IO1  (via drill 0.3)
  Top 0.254: U1.11 24.05,43.26 24.77,42.55 24.77,38.48 v24.26,37.97 | U11.DIO1 3.73,43.26 10.16,36.83 v15.24,36.83
  Bottom 0.254: v24.26,37.97 23.11,36.83 v15.24,36.83
ESP_IO27/RFM_IO0  (via drill 0.3)
  Top 0.254: U11.DIO0 4.27,45.26 11.43,38.1 v15.24,38.1 | U1.12 23.16,41.99 23.88,41.27 23.88,38.61 23.62,38.35 v22.99,38.35
  Bottom 0.254: v22.99,38.35 22.73,38.1 v15.24,38.1
ESP_IO32/V_BATT_2  (via drill 0.3)
  Top 0.254: R9.2 R25.1 v47.62,38.1 | U1.8 22.83,46.99 v24.38,46.99
  Bottom 0.254: v24.38,46.99 24.77,47.37 24.77,50.16 28.32,53.72 36.96,53.72 37.34,53.34 41.4,53.34 43.69,51.05 47.12,51.05 47.62,51.56 49.28,51.56 50.19,50.65 50.19,48.54 47.12,45.47 47.12,38.61 v47.62,38.1
ESP_IO33  (via drill 0.3)
  Top 0.254: U1.9 22.67,45.72 v21.34,45.72
  Bottom 0.254: v21.34,45.72 21.34,47.24 19.81,48.77 16.26,48.77 13.46,45.97 13.46,31.5 21.08,23.88 21.08,16.26 27.18,10.16 29.84,10.16 J7.4
GND  (via drill 0.3)
  Top 0.254: U5.1 2.61,10.87 v2.54,10.79 2.54,10.46 U5.7 3.81,9.2 v3.81,7.62 | U6.20 32.35,22.57 v32.38,22.61 | U6.18 34.02,21.32 v34.04,21.34 | U10.11 34.08,29.46 34.08,30.06 C18.2 | U9.P6 33.66,34.29 v33.66,34.8 33.65,34.79 U9.P7 | 48.68,33.45 50.04,33.45 | v10.79,6.99 10.41,6.99 9.53,7.87 | v27.3,25.4 28.36,25.4 C10.2 | R1.1 55.89,63.09 58.83,63.09 v59.05,62.87 | 53.34,43.69 53.34,43.18 53.34,42.67 | 50.8,43.81 50.8,43.31 50.93,43.18 50.8,43.05 50.8,42.55
  Top 0.508: J2.1 55.72,43.18 53.34,43.18 J6.2 50.93,43.18
  Bottom 0.254: BME_ADR.1 3.06,10.27 v2.54,10.79
  other vias: 52.07,27.94 50.8,22.86 50.8,24.13 50.8,21.59 50.8,25.4 52.07,25.4 61.21,37.21 59.69,34.92 61.47,33.66 22.86,37.47 20.95,40.51 14.61,45.09 53.34,27.94 54.61,27.94 52.26,29.21 50.42,27.94 48.26,29.84 48.26,31.75 52.26,30.23 50.55,31.75 53.98,26.04 55.24,26.04 45.72,29.84 45.72,22.86 46.99,21.59 48.26,20.32 49.53,19.05 51.44,18.41 53.34,22.86 53.34,24.13 52.7,49.53 49.53,49.53 54.61,48.26 46.99,56.64 36.2,51.56 42.55,53.85 42.67,48.26 38.73,56.64 42.55,56.64 55.24,35.56 53.34,35.56 52.07,36.83 51.44,35.31 47.62,35.31 53.98,29.84 29.21,35.43 27.3,31.11 6.35,13.97 1.27,13.97 19.43,42.67 25.4,39.37 27.94,32.38 33.15,30.61 34.92,31.11 29.59,30.48 33.66,33.02 35.56,34.29 33.66,36.2 30.23,45.59 28.45,45.59 32,45.59 33.27,46.86 33.27,48.64 33.27,50.42 30.23,51.69 27.18,48.64 27.18,46.86 27.18,50.42 28.45,51.69 32,51.69 24.77,55.88 20.95,55.88 9.53,62.87 5.71,62.87 0.64,59.05 0.64,53.34 16.51,55.37 19.68,55.37 14.61,41.27 18.03,40.01 53.34,21.59 53.34,18.41 57.15,19.05 43.18,22.86 43.18,25.4 45.72,27.94 53.34,20.32 52.07,20.32 55.24,18.41 56.52,21.34 62.87,21.59 59.05,17.78 23.5,19.68 24.77,19.3 41.91,13.97 23.5,17.14 23.5,20.95 24.77,20.95 36.2,39.12 39.12,36.83 36.2,49.78 32.38,41.27 49.53,56.52 52.07,56.52 53.98,57.78 53.98,62.87 62.87,59.05 62.87,46.74 62.23,41.91 46.99,48.26 45.72,36.83 43.81,36.83 48.51,7.37 50.8,6.99 0.64,4.45 4.45,0.64 3.81,6.35 0.64,19.05 1.27,21.59 62.87,19.05 62.87,15.88 55.88,8.89 54.61,10.16 57.15,12.7 31.75,0.64 48.26,0.64 62.87,4.45 59.05,0.64 62.87,29.21 15.24,0.64 0.64,40.01 6.35,48.26 5.08,49.53 11.43,53.34 10.16,54.61 16.51,53.34 10.79,44.45 10.79,40.64 12.7,49.53 0.64,15.88 0.64,8.26 7.62,11.43 27.94,24.13 30.48,25.4 32.38,26.8 35.56,25.4 37.47,33.02 39.37,26.04 45.72,19.05 48.26,15.24 39.37,23.5 41.27,18.41 10.16,17.78 26.04,34.67 24.13,48.26 27.94,41.91 26.67,54.61 24.13,52.07 19.81,51.44 46.48,43.18 27.3,15.88 35.81,15.24 34.54,45.72 30.61,36.7 41.91,51.69 42.34,49.54 39.37,55.12 36.2,52.7 37.47,53.98 49.02,50.93 49.02,52.2 25.4,49.53 47.62,9.91 50.16,9.91 45.21,9.91 17.14,9.53 21.46,43.69 38.99,51.82 43.18,30.48 42.16,41.02 32.38,12.06 51.44,13.97 55.24,13.34 1.91,56.52 3.17,57.78 4.45,59.05 5.71,57.15 4.83,56.13 3.81,55.24 5.71,59.69 9.14,59.69 9.14,57.15 7.62,55.88 7.62,60.96 0.64,55.24 44.45,46.61 46.99,46.99 54.61,50.8 54.61,55.88 54.61,53.34 52.07,48.26 56.52,57.4 56.26,46.61 58.42,45.72 51.44,52.07 51.18,39.37 54.86,39.88 45.47,40.01 15.24,22.86 13.97,22.23 7.11,19.3 26.67,12.7 22.86,10.16 31.75,6.35 24.13,6.99 15.24,13.59 16.51,13.59 18.41,20.32 7.87,21.59 7.62,17.78 10.79,34.92 10.79,29.84 13.34,26.04 17.78,29.21 14.61,36.2 19.05,27.94 16.51,23.5 12.7,23.5 57.78,10.79 8.89,6.35 15.24,4.45 31.75,4.45 23.5,4.45 20.32,33.66 22.23,32.38 27.81,36.2 22.23,19.68 22.23,18.41 22.23,22.23 6.99,8.26 5.08,22.86 8.89,25.4 25.4,40.64 19.05,38.73 16.64,47.5 19.05,36.2 16.26,43.81 29.84,12.06 14.61,37.47 3.81,44.45 5.08,40.64 7.62,43.18 35.05,23.62 36.2,20.32 37.47,20.32 38.1,13.97 43.18,15.24 0.64,34.92 0.64,28.57 4.45,27.3 4.45,36.2 39.37,18.41 31.75,28.7 24.13,28.32 28.45,27.3 22.86,25.4 24.89,24 26.67,29.21 38.35,15.49 59.05,57.78 56.9,61.28 56.52,44.96 56.01,41.91 50.42,46.1 53.98,46.35 56.39,39.88 58.42,38.1 55.12,37.59 58.17,32.64 49.15,44.45 47.75,38.86 40.01,7.62 37.47,8.26 36.2,5.71 41.02,5.97 42.16,7.87 13.97,19.68
  pour Top (isolate 0.178, rank 2): 0,0 63.5,0 63.5,63.5 0,63.5
  cutout Top (isolate 0.305): 1.65,13.59 1.02,12.95 1.02,8.64 1.65,8 5.97,8 6.6,8.64 6.6,12.95 5.97,13.59
  pour Bottom (isolate 0.178, rank 2): 63.5,0 0,0 0,63.5 63.5,63.5
GND2
  cutout Bottom (isolate 0.305): 5.97,13.59 6.6,12.95 6.6,8.64 5.97,8 1.65,8 1.02,8.64 1.02,12.95 1.65,13.59
ICM_INT  (via drill 0.3)
  Top 0.254: Q5.3 v36.83,26.67
  Bottom 0.254: v36.83,26.67 36.83,30.48 36.2,31.11 36.2,36.2 38.1,38.1 ICM_INT.2
ICM_INT_1V8  (via drill 0.3)
  Top 0.254: U6.12 32.75,18.05 33.02,17.78 v33.66,17.78 | Q4.1 36.33,17.78 | 36.33,17.78 36.33,18.7 R18.2 | v35.56,17.78 36.33,17.78
  Bottom 0.254: v33.66,17.78 v35.56,17.78
ISM_INT1  (via drill 0.3)
  Top 0.254: U9.P4 32.5,32.52 v32.64,32.38
  Bottom 0.254: v32.64,32.38 32.38,32.64 32.38,36.2 34.92,38.73 34.92,39.49 36.08,40.64 37.85,40.64 38.1,40.89 ISM_INT1.2
ISM_INT2  (via drill 0.3)
  Top 0.254: U9.P9 32,35.95 v31.75,36.2
  Bottom 0.254: v31.75,36.2 34.42,38.86 34.42,39.62 35.56,40.77 35.56,42.55 36.2,43.18 37.85,43.18 38.1,43.43 ISM_INT2.2
MMC_INT  (via drill 0.3)
  Top 0.254: U10.15 31.51,31.73 v31.5,31.75
  Bottom 0.254: v31.5,31.75 31.11,32.13 31.11,36.32 33.91,39.12 33.91,39.75 35.05,40.89 35.05,42.67 35.56,43.18 35.56,45.09 36.2,45.72 37.85,45.72 38.1,45.97 MMC_INT.2
N$1
  Top 0.254: D4.C 40.25,33.05 R24.2
N$2
  Top 0.508: U2.3 53.02,25.13 52.27,24.38 L1.P$1
N$3
  Top 0.254: R4.1 51.22,32.6 MEAS.4
  Top 0.508: C1.1 53.42,28.84 U2.4 53.02,30.8 MEAS.4
  Bottom 0.254: MEAS.2 MEAS.4
N$4  (via drill 0.3)
  Top 0.254: v56.52,53.34 56.52,53.47 56.16,53.82 J1.B5 | v57.78,61.21 56.77,62.23 R1.2
  Bottom 0.254: v56.52,53.34 57.15,53.34 58.42,54.61 58.42,59.69 57.78,60.33 v57.78,61.21
N$5  (via drill 0.3)
  Top 0.254: J1.A5 56.49,50.82 v56.52,50.8 | v57.78,59.31 56.77,60.33 R2.2
  Bottom 0.254: v56.52,50.8 55.88,51.44 55.88,53.46 56.4,53.98 56.9,53.98 57.78,54.86 v57.78,59.31
N$6
  Top 0.508: Q1.2 54.49,35.63 D1.C 54.61,34.17 MEAS.3
  Bottom 0.254: MEAS.1 MEAS.3
N$7
  Top 0.254: U2.5 51.12,28.99 50.92,28.79 C2.1 R5.1 R6.2
N$8
  Top 0.254: D3.C 58.74,31.82 U3.1
N$9  (via drill 0.3)
  Top 0.254: D3.A v61.21,31.75
  Bottom 0.254: v61.21,31.75 CHG.2
N$10  (via drill 0.3)
  Top 0.254: v58.67,30.48 58.25,30.9 R7.1
  Bottom 0.254: v58.67,30.48 58.67,30.99 59.17,31.48 CHG.1
N$11
  Top 0.254: R8.2 57.34,36.23 U3.5
N$12  (via drill 0.3)
  Top 0.254: C6.1 54.74,58.13 v54.74,57.51 | v52.58,51.44 U8.4
  Bottom 0.254: v54.74,57.51 54.74,57.4 52.58,55.24 v52.58,51.44
N$13  (via drill 0.3)
  Top 0.254: R13.1 3.81,15.03 v3.81,14.61 | U5.5 5.01,10.72 v5.08,10.79
  Bottom 0.254: v3.81,14.61 BME_ADR.2 4.56,11.32 v5.08,10.79
N$14
  Top 0.254: U6.10 31.95,16.91 C13.1
N$15  (via drill 0.3)
  Top 0.254: R12.2 53.12,14.61 v52.07,14.61
  Bottom 0.254: I2C.1 52.7,15.24 v52.07,14.61
N$16  (via drill 0.3)
  Top 0.254: R11.2 56.09,14.61 v57.15,14.61
  Bottom 0.254: v57.15,14.61 56.52,15.24 I2C.3
N$17  (via drill 0.3)
  Top 0.254: U6.9 31.55,16.91 R14.1 29.76,16.09 v29.72,16.13
  Bottom 0.254: ICM_ADR.2 30.1,16.51 v29.72,16.13
N$18
  Top 0.254: Q6.5 43.69,50.16 43.31,50.55 43.31,53.68 R20.2
N$19
  Top 0.254: Q6.2 45.59,50.16 45.34,50.42 45.34,52.11 R19.2
N$20
  Top 0.254: C18.1 34.32,28.96 U10.10
N$21  (via drill 0.3)
  Top 0.254: U9.P1 27.62,33.13 R21.1 26.25,33.44 v26.04,33.66
  Bottom 0.254: v26.04,33.66 26.26,33.88 ISM_ADR.2
N$22
  Top 0.254: C19.1 18.2,17.4 17.14,18.45 U12.6
N$23
  Top 0.254: D2.C R10.2
N$24  (via drill 0.3)
  Top 0.254: C21.1 v17.14,14.61
  Bottom 0.254: v17.14,14.61 15.76,15.99 NAU_CAP.1
N$25
  Top 1.143: U11.ANT 5.42,58.42 J4.FEED
N$26  (via drill 0.3)
  Top 0.254: R10.1 44.03,33.02 v43.18,33.02
  Bottom 0.254: v43.18,33.02 43.43,33.02 44.18,32.27 PWR.2
N$27
  Top 0.254: U12.3 13.34,18.54 14.1,17.78 14.82,17.78 C20.2 R23.2
N$28
  Top 0.254: R22.2 11.6,15.62 13.5,15.62 C20.1 13.12,17.78 12.7,17.78 12.06,18.41 U12.2
N$29
  Top 0.254: U12.12 15.88,25.4 14.61,26.67 D6.A
N$30
  Top 0.254: Q4.3 36.83,20.74 R17.1 35.88,21.69 Q5.1
N$31
  Top 0.254: Q11.3 49.15,41.19 R31.1 48.2,42.14 Q10.1
N$32
  Top 0.254: C14.1 U8.16 48.25,47.62 49.15,46.73 Q10.3
NAU_A+
  Top 0.254: R23.1 14.39,13.76 J5.2
NAU_A-
  Top 0.254: R22.1 10.79,13.12 J5.1
NAU_B+
  Top 0.254: U12.5 15.88,18.41 17.14,17.14 17.14,16.16 17.68,15.62 18.88,15.62 C21.2 18.63,13.34 17.14,13.34 16.64,12.83 16,12.83 J5.4
NAU_B-  (via drill 0.3)
  Top 0.254: v14.61,20.32 U12.4
  Bottom 0.254: NAU_CAP.2 14.72,20.19 14.61,20.31 v14.61,20.32 13.72,20.32 12.32,18.92 12.32,15.62 13.34,14.61 13.34,10.79 13.97,10.16 14.61,10.16 J5.5
NAU_INT  (via drill 0.3)
  Top 0.254: D6.C v20.95,31.23 v20.95,31.24
  Bottom 0.254: NAU_INT.2 38.1,48.51 37.85,48.26 36.2,48.26 20.95,33.02 v20.95,31.24
RTS
  Top 0.254: R19.1 44.16,52.63 Q6.4 44.56,50.81 44.83,50.55 44.83,49.66 45.47,49.02 46.48,49.02 47.62,50.16 U8.14
SCL_1V8  (via drill 0.3)
  Top 0.254: R16.1 26.17,18.7 Q3.2 26,17.78 v25.4,17.78 | U6.23 31.15,22.7 30.73,23.11 29.46,23.11 27.94,21.59 v27.94,20.32
  Bottom 0.254: v27.94,20.32 v25.4,17.78
SCL_OUT  (via drill 0.3)
  Top 0.254: U5.4 4.32,12.69 4.32,13.34 6.22,15.24 6.22,16.76 5.08,17.91 J10.4 6.45,18.82 v6.6,18.67 | R30.1 24.9,26.95 Q9.2 24.82,25.78 v24.13,25.78 | v28.57,33.78 29.08,34.29 U9.P13 | v28.57,31.11 29.84,31.11 30.25,30.71 U10.1 | U12.13 v14.61,21.59 19.05,21.59 21.59,19.05 v22.86,19.05 25.45,16.46 Q3.3
  Bottom 0.254: v28.57,33.78 v28.57,31.11 28.57,30.23 v24.13,25.78 22.86,24.51 v22.86,19.05 | v6.6,18.67 9.78,18.67 12.7,21.59 v14.61,21.59
SDA_1V8  (via drill 0.3)
  Top 0.254: R15.1 26.17,22.51 Q2.2 26,21.59 v25.4,21.59 | U6.24 30.75,22.34 30.48,22.61 29.84,22.61 29.21,21.97 v29.21,21.59
  Bottom 0.254: v25.4,21.59 v29.21,21.59
SDA_OUT  (via drill 0.3)
  Top 0.254: U5.3 3.83,12.37 3.83,13.61 5.59,15.37 5.59,16.51 3.81,18.29 3.81,19.43 4.2,19.82 J10.3 6.49,19.82 v6.6,19.94 | Q8.2 24.9,31.02 R29.1 25.31,32.13 27.3,32.13 27.69,31.75 v30.48,31.75 31.01,31.22 U10.16 | v29.97,33.76 30,33.79 U9.P14 | v13.34,22.86 U12.14 13.34,24.64 14.1,25.4 14.99,25.4 15.24,25.15 15.24,23.62 16,22.86 20.32,22.86 22.86,20.32 v24.13,20.32 26.62,20.32 Q2.3
  Bottom 0.254: v29.97,33.76 29.97,32.26 v30.48,31.75 30.48,30.48 24.13,24.13 v24.13,20.32 | v6.6,19.94 8.51,19.94 11.43,22.86 v13.34,22.86
SHLD
  pour Top (isolate 0.178): 61.59,47.75 61.59,56.39 55.24,56.39 55.24,55.88 55.88,55.88 58.17,53.59 58.17,50.55 55.88,48.26 55.24,48.26 55.24,47.75
  pour Bottom (isolate 0.178): 61.59,47.75 61.59,56.39 55.24,56.39 55.24,55.88 56.52,55.88 56.52,55.24 58.17,53.59 58.17,50.55 56.52,48.9 56.52,48.26 55.24,48.26 55.24,47.75
USB_DN
  Top 0.254: J1.A7 56.17,52.32 56.39,52.1 56.39,51.54 56.17,51.32 J1.B7 54.94,51.32 54.19,52.07 52.9,52.07 52.7,52.28 52.7,53.13 53.54,53.98 U8.6
USB_DP
  Top 0.254: J1.A6 55.56,51.84 54.98,51.84 54.74,52.09 54.74,52.7 | U8.5 54.74,52.7 | 54.74,52.7 54.85,52.82 J1.B6
V_BATT  (via drill 0.3)
  Top 0.254: R25.2 51.27,38.1 52.07,38.9 J6.1
  Top 0.508: v62.23,33.66 C5.1 61.39,32.6 60.64,33.35 U3.3 | v62.23,40.64 61.96,40.91 J2.2 55.74,40.66 55.63,40.66 | J6.1 52.09,40.66 55.63,40.66 | Q1.3 54.44,37.93 55.63,39.12 55.63,40.66
  Bottom 0.508: v62.23,40.64 v62.23,33.66
V_USB  (via drill 0.3)
  Top 0.254: Q11.1 50.16,40.21 v50.16,40.13
  Top 0.508: v55.88,45.72 v55.24,45.72 54.36,45.72 D5.A
  Bottom 0.254: v50.16,40.13 50.16,43.81 52.07,45.72 v55.24,45.72
  Bottom 0.508: v57.15,52.7 v57.15,51.44 57.78,50.8 57.78,46.99 56.52,45.72 v55.88,45.72 v55.24,45.72
  pour Top (isolate 0.178, no thermals): 55.24,54.74 56.39,54.74 57.78,53.34 57.78,50.8 56.39,49.4 55.24,49.4
VDDA  (via drill 0.3)
  Top 0.254: 10.79,22.44 U12.1 10.79,18 C23.1 v13.34,16.51 | 10.79,22.44 U12.16 | C22.1 10.79,22.44
  Bottom 0.254: v13.34,16.51 15.88,13.97 15.88,12.7 J5.6 17.14,10.79 18.41,9.53 J5.7
VOUT  (via drill 0.3)
  Top 0.254: U12.15 12.06,24.77 11.43,25.4 10.16,25.4 7.12,22.36 7.12,20.82 | 29.57,28.46 29.46,28.36 C17.1 | 29.57,28.46 U10.4 | 29.57,28.46 29.57,29.31 29.72,29.46 U10.2 31.88,29.46 32.51,30.1 U10.13 32.51,30.99 32.77,31.24 33.82,31.24 34.71,32.13 C16.1 | 31.75,26.04 31.75,26.67 31.4,27.02 29.91,27.02 C17.1 | 31.75,26.04 31.75,25.02 32.02,24.75 U7.1 34.09,24.75 C9.1 35.14,24.55 35.81,23.88 37.08,23.88 37.78,23.18 Q5.2 37.78,21.69 R17.2 40.01,19.27 Q7.3 | C16.1 33.94,33.79 U9.P5 32.25,33.79 31.25,34.79 U9.P12 27.66,34.79 R21.2 | U9.P8 32.61,35.56 C15.1 C16.1 | U7.3 31.77,26.05 31.75,26.04 | v3.05,20.83 2.96,20.74 R13.2 2.96,13.84 3.41,13.39 U5.2 3.41,11.2 4.21,10.39 U5.6 4.59,9.21 4.59,7.26 C7.1 C8.1 3.05,7.28 3.05,9.16 U5.8 | v3.05,32.26 3.09,32.3 J12.3 | J10.2 | R29.2 25.9,31.02 Q8.1 25.9,27.66 R30.2 | Q9.1 25.9,26.95 R30.2 | R30.2 26.63,27.69 27.05,27.69 27.73,28.36 C17.1
  Top 0.508: v3.05,20.83 J10.2 | U11.3.3V 3.79,47.26 v3.81,47.24
  Top 0.635: Q7.3 v40.01,11.43 v40.01,10.79 | J10.2 7.12,20.82 8.89,19.05 8.89,7.62 10.79,5.71 29.21,5.71 J7.5
  Bottom 0.508: v3.05,20.83 v3.05,32.26 3.05,46.48 v3.81,47.24
  Bottom 0.635: J9.5 46.99,6.99 41.91,6.99 40.01,8.89 | 40.01,8.89 v40.01,10.79 v40.01,11.43 | J7.5 34.29,6.99 38.1,6.99 40.01,8.89

## Text on the board
Bottom: v11
Milling: ROUTE OUT | ROUTE OUT | ROUTE OUT | ROUTE OUT
Measures: Units: inches
tDocu: Solder Mask: Red / Thickness: 1.6mm / Two layer design / Finish: Lead Free HASL | Dryw Wade